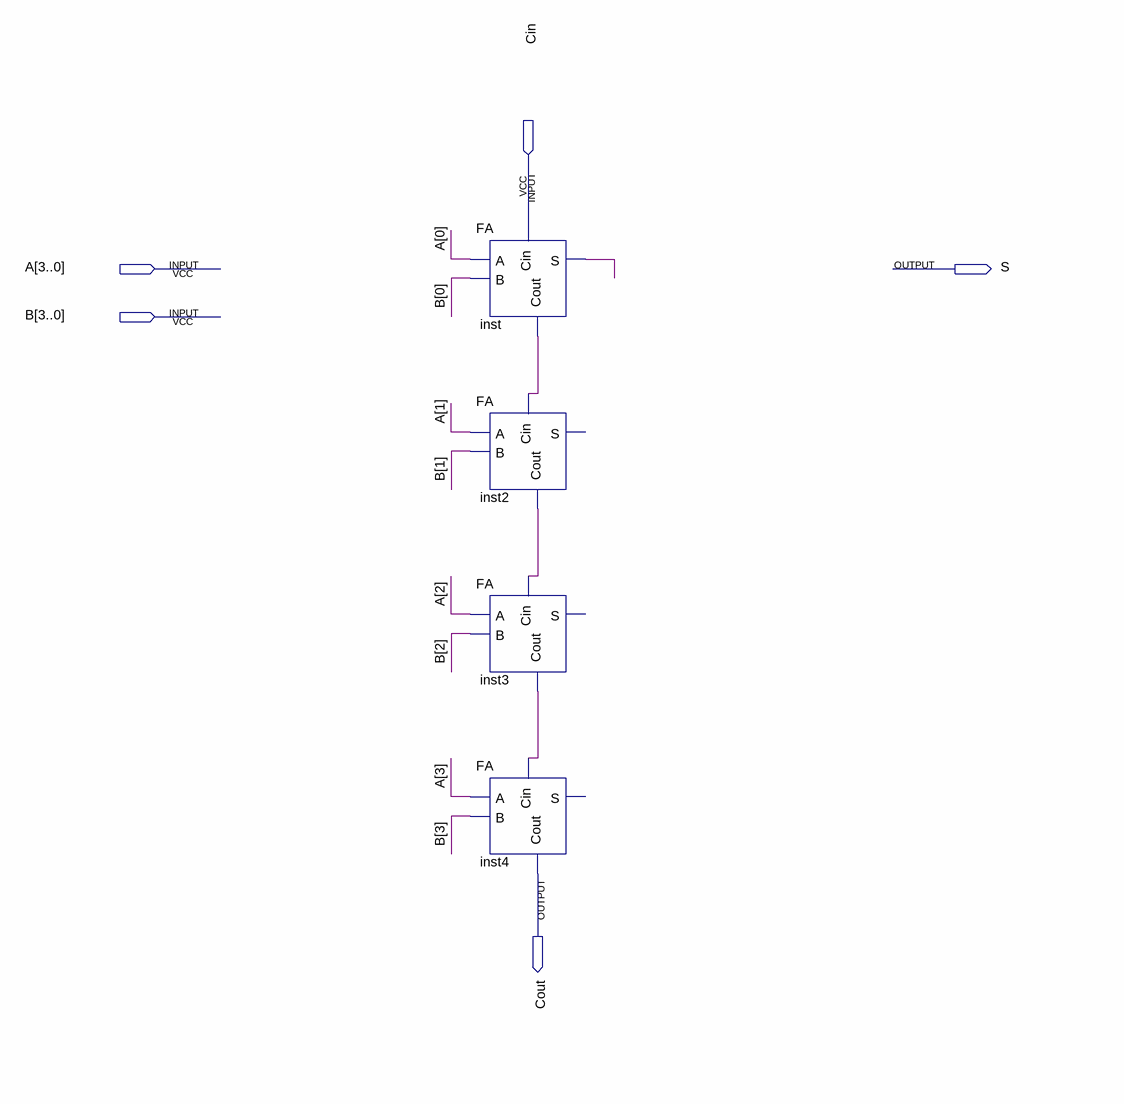
[diagram p0: schematic sheet]
// Quartus schematic FA_4bit.bdf as structural Verilog: 4 symbols, 5 pins
module FA_4bit (
  input  Cin,
  input  [3:0] A,
  input  [3:0] B,
  output S,
  output Cout
);

  wire inst2_cout, inst3_cout, inst_cout, inst_s;

  FA inst (.A(A[0]), .B(B[0]), .Cin(Cin), .S(inst_s), .Cout(inst_cout));
  FA inst2 (.A(A[1]), .B(B[1]), .Cin(inst_cout), .Cout(inst2_cout));  // open: S
  FA inst3 (.A(A[2]), .B(B[2]), .Cin(inst2_cout), .Cout(inst3_cout));  // open: S
  FA inst4 (.A(A[3]), .B(B[3]), .Cin(inst3_cout), .Cout(Cout));  // open: S
endmodule
